# EAGLE design GW-RFM-V40-Mini011 (EAGLE 9.1.0)
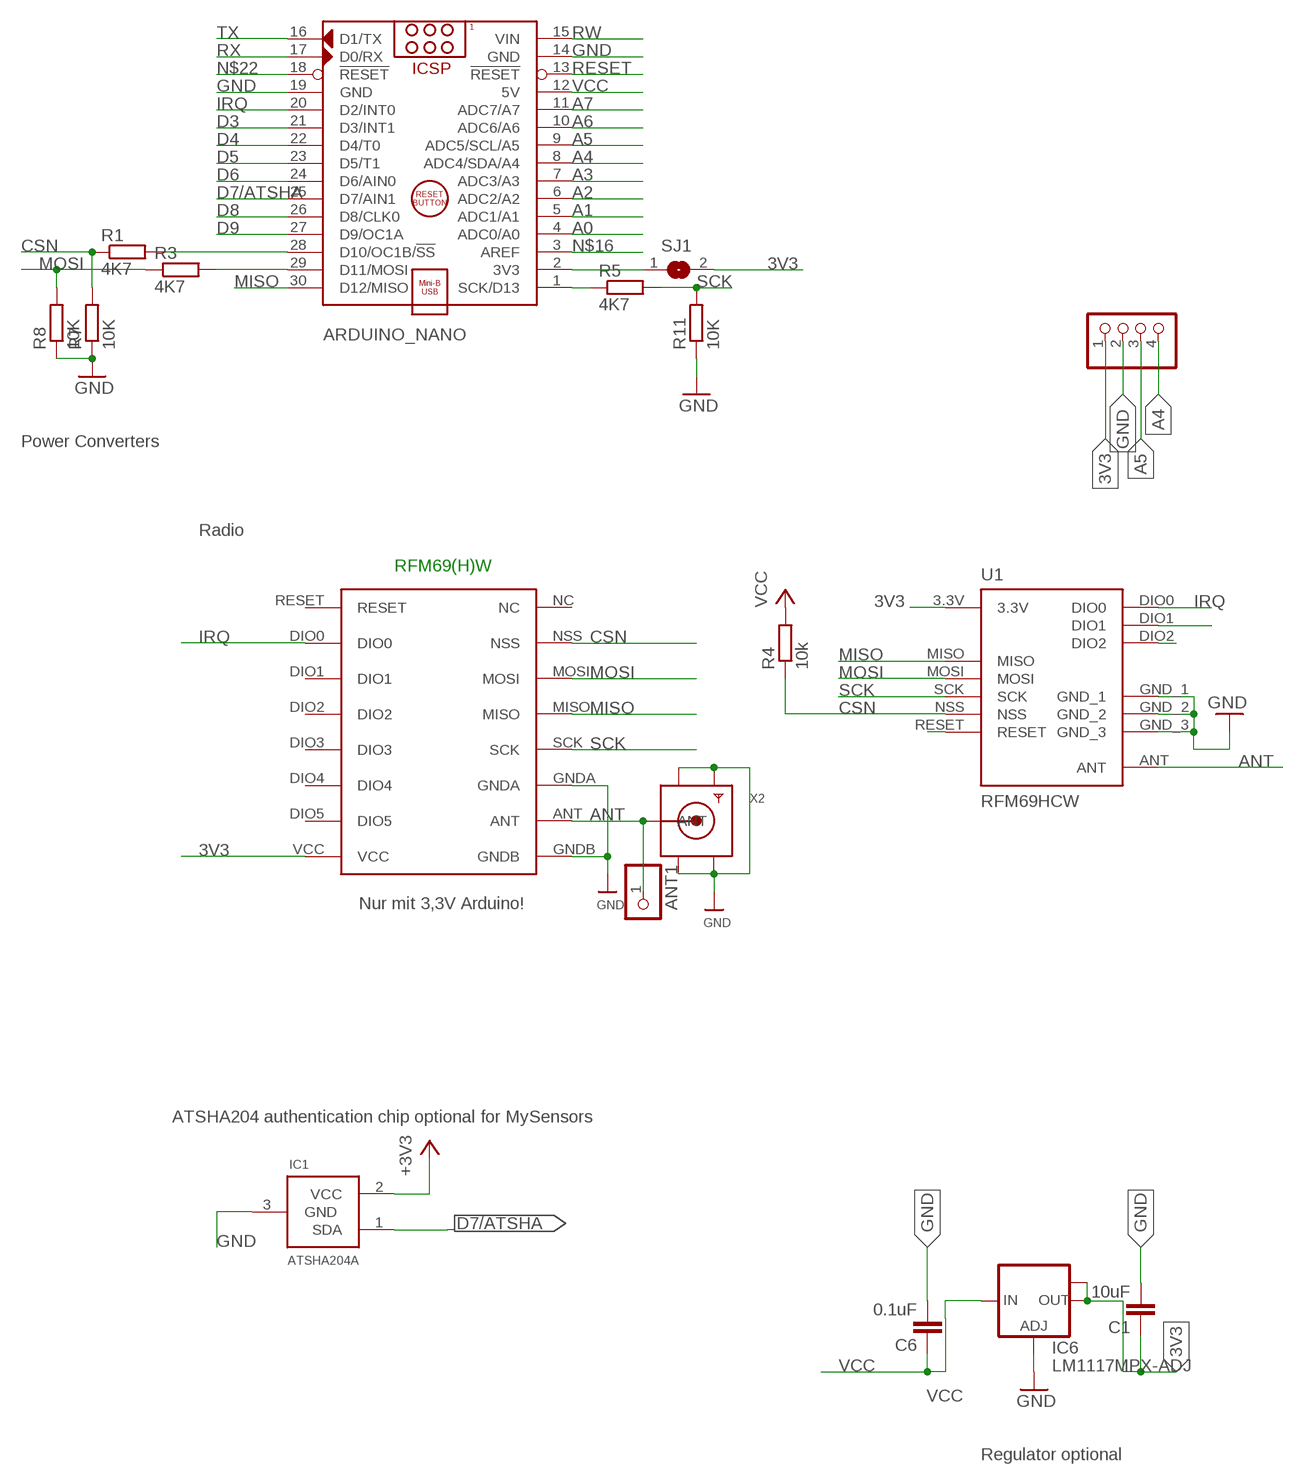
[diagram p0: schematic, sheet 1]

## Parts
ANT1  PINHD-1X1  [1X01]
ARDUINO_NANO  ARDUINO_NANO_OHNE-BOHR  [ARDUINO_NANO]
C1  10uF  C-EUC1210  [C1210]
C6  0.1uF  C-EUC1206  [C1206]
IC1  ATSHA204A  [SOT23]
IC6  LM1117MPX-ADJ  [SOT223]
JP17  PINHD-1X04_2.54-S  [1X04-S]
R1  4K7  R-EU_M0805  [M0805]
R3  4K7  R-EU_M0805  [M0805]
R4  10k  R-EU_M0805  [M0805]
R5  4K7  R-EU_M0805  [M0805]
R7  10K  R-EU_M0805  [M0805]
R8  10K  R-EU_M0805  [M0805]
R11  10K  R-EU_M0805  [M0805]
RFM69W  RFM69HW  [RFM]
SJ1  SJ  [SJ]
U1  RFM69HCW  [RFM69HCW-XXXS2]
X2  SMACONNECTOR_EDGE  [SMA_EDGELAUNCH]

## Nets
3V3: C1.1 IC1.2(VCC) IC6.2(OUT) IC6.TAB(OUT1) JP17.1 RFM69W.VCC SJ1.2 U1.3.3V ; supply symbol labelled +3V3
A0: ARDUINO_NANO.4(ADC0/A0)
A1: ARDUINO_NANO.5(ADC1/A1)
A2: ARDUINO_NANO.6(ADC2/A2)
A3: ARDUINO_NANO.7(ADC3/A3)
A4: ARDUINO_NANO.8(ADC4/SDA/A4) JP17.4
A5: ARDUINO_NANO.9(ADC5/SCL/A5) JP17.3
A6: ARDUINO_NANO.10(ADC6/A6)
A7: ARDUINO_NANO.11(ADC7/A7)
ANT: ANT1.1 RFM69W.ANT U1.ANT X2.P(ANT)
CSN: R1.1 R4.1 R7.2 RFM69W.NSS U1.NSS
D3: ARDUINO_NANO.21(D3/INT1)
D4: ARDUINO_NANO.22(D4/T0)
D5: ARDUINO_NANO.23(D5/T1)
D6: ARDUINO_NANO.24(D6/AIN0)
D7/ATSHA: ARDUINO_NANO.25(D7/AIN1) IC1.1(SDA)
D8: ARDUINO_NANO.26(D8/CLK0)
D9: ARDUINO_NANO.27(D9/OC1A)
GND [Power]: ARDUINO_NANO.14(GND) ARDUINO_NANO.19(GND) C1.2 C6.2 IC1.3(GND) IC6.1(ADJ) JP17.2 R7.1 R8.1 R11.1 RFM69W.GNDA RFM69W.GNDB U1.GND_1 U1.GND_2 U1.GND_3 X2.GND@1(GND4) X2.GND@2(GND3) X2.GND@3(GND2) X2.GND@4(GND1)
IRQ: ARDUINO_NANO.20(D2/INT0) RFM69W.DIO0 U1.DIO0
MISO: ARDUINO_NANO.30(D12/MISO) RFM69W.MISO U1.MISO
MOSI: R3.1 R8.2 RFM69W.MOSI U1.MOSI
N$3: ARDUINO_NANO.2(3V3) SJ1.1
N$5: ARDUINO_NANO.1(SCK/D13) R5.1
N$8: ARDUINO_NANO.28(D10/OC1B/!SS) R1.2
N$9: ARDUINO_NANO.29(D11/MOSI) R3.2
N$12: U1.DIO2
N$13: U1.RESET
N$15: U1.DIO1
N$16: ARDUINO_NANO.3(AREF)
N$22: ARDUINO_NANO.18(!RESET)
RESET: ARDUINO_NANO.13(!RESET)
RW: ARDUINO_NANO.15(VIN)
RX: ARDUINO_NANO.17(D0/RX)
SCK: R5.2 R11.2 RFM69W.SCK U1.SCK
TX: ARDUINO_NANO.16(D1/TX)
VCC [Power]: ARDUINO_NANO.12(5V) C6.1 IC6.3(IN) R4.2
Unconnected: RFM69W.DIO1 RFM69W.DIO2 RFM69W.DIO3 RFM69W.DIO4 RFM69W.DIO5 RFM69W.NC RFM69W.RESET

## Notes on the sheet
- Power Converters
- Radio
- RFM69(H)W
- Nur mit 3,3V Arduino!
- ATSHA204 authentication chip optional for MySensors
- Regulator optional

## Library data of the parts
ANT1 = pinhead:PINHD-1X1: PIN HEADER
ARDUINO_NANO = ArduinoNanoV30:ARDUINO_NANO_OHNE-BOHR: Arduino Nano V3.0 Module Overview: The Arduino Nano is a small, complete, and breadboard-friendly board based on the ATmega328 (Arduino Nano 3.x) or ATmega168 (Arduino Nano 2.x). It has more or less the same functionality of the Arduino Duemilanove, but in a different package. It lacks only a DC power jack, and works with a Mini-B USB cable instead of a standard one. The Nano was designed and is being produced by Gravitech <http://www.gravitech.us/arna30wiatp.html>. General specifications: Item Value Microcontroller Atmel ATmega168 or ATmega328 Operating Voltage (logic level) 5 V Input Voltage (recommended) 7-12 V Input Voltage (limits) 6-20 V Digital I/O Pins 14 (of which 6 provide PWM output) Analog Input Pins 8 DC Current per I/O Pin 40 mA Flash Memory 16 KB (ATmega168) or 32 KB (ATmega328) of which 2 KB used by bootloader SRAM 1 KB (ATmega168) or 2 KB (ATmega328) EEPROM 512 bytes (ATmega168) or 1 KB (ATmega328) Clock Speed 16 MHz Dimensions (Inches) 0.73" x 1.70" Dimensions (mm) 18mm x 45mm Overall height About 9 mm (not including pins) Weigth 5 g Power: The Arduino Nano can be powered via the Mini-B USB connection, 6-20V unregulated external power supply (pin 30), or 5V regulated external power supply (pin 27). The power source is automatically selected to the highest voltage source. Memory: The ATmega168 has 16 KB of flash memory for storing code (of which 2 KB is used for the bootloader); the ATmega328 has 32 KB, (also with 2 KB used for the bootloader). The ATmega168 has 1 KB of SRAM and 512 bytes of EEPROM (which can be read and written with the EEPROM library); the ATmega328 has 2 KB of SRAM and 1 KB of EEPROM. Input and Output: Each of the 14 digital pins on the Nano can be used as an input or output, using pinMode(), digitalWrite(), and digitalRead() functions. They operate at 5 volts. Each pin can provide or receive a maximum of 40 mA and has an internal pull-up resistor (disconnected by default) of 20-50 kOhms. In addition, some pins have specialized functions. Visit Arduino - ArduinoBoardNano <https://www.arduino.cc/en/Main/ArduinoBoardNano>
C1 C6 = rcl:C-EU: CAPACITOR, European symbol
IC1 = Sensor:ATSHA204A
IC6 = lm1117:LM1117MPX-ADJ
JP17 = pinhead-2:PINHD-1X04: PIN HEADER
R1 R3-R5 R7 R8 R11 = rcl:R-EU_: RESISTOR, European symbol
RFM69W = hoperf:RFM69HW
SJ1 = jumper:SJ: SMD solder JUMPER
U1 = doug:RFM69H
X2 = adafruit:SMACONNECTOR: SMA Connector 90° DIP SMA Connector, 50 Ohm (4UConnector: 07259)

## Net classes
0 default: width 0.254 mm
1 Power: width 0.406 mm

## Board
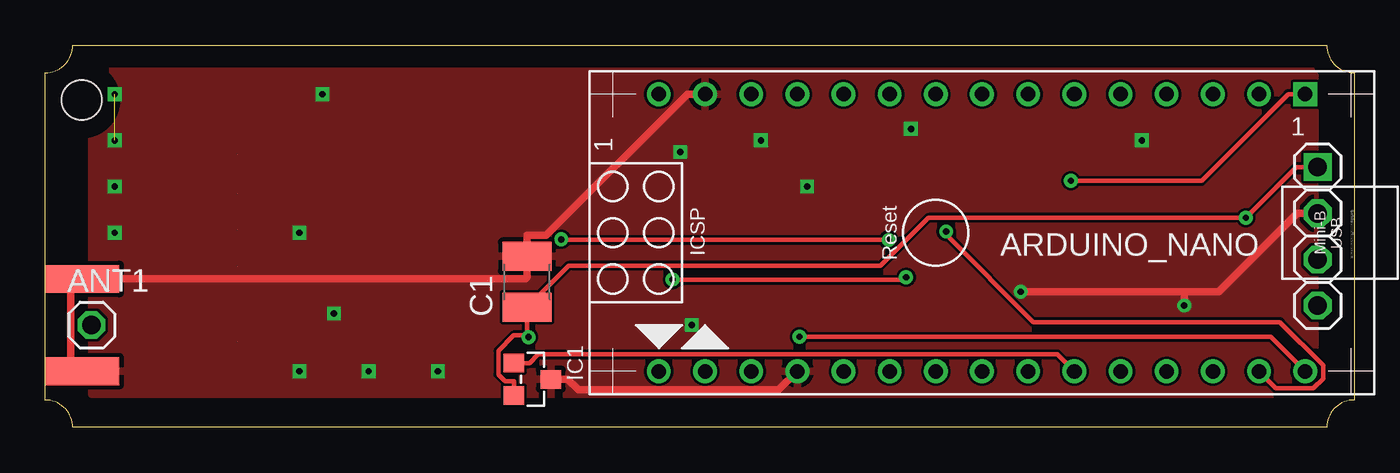
[diagram p1: board, top side]
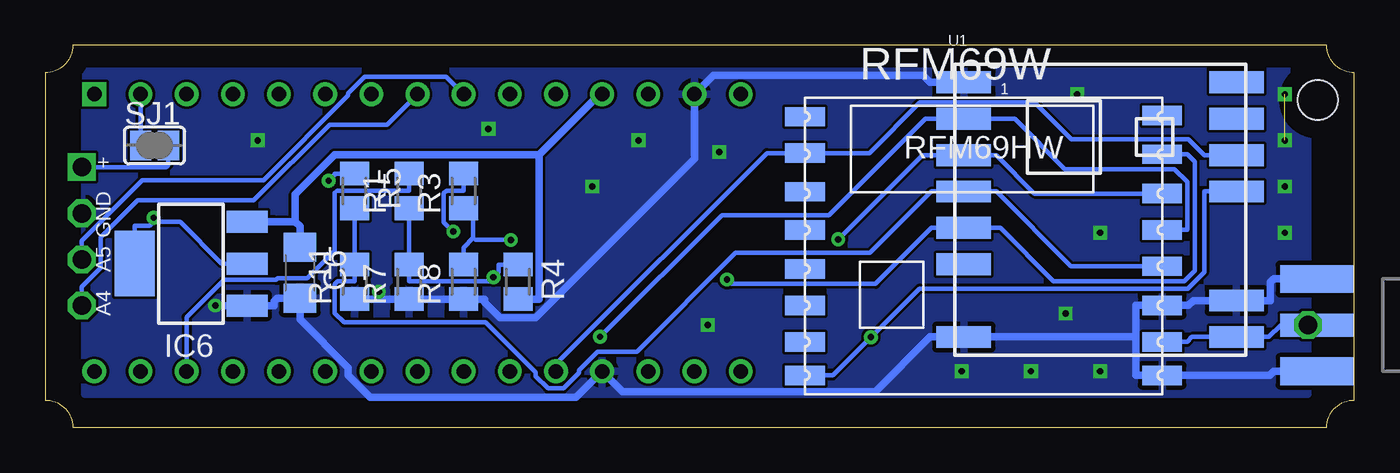
[diagram p2: board, bottom side, seen from below]

Size 72 x 21 mm. Coordinates in mm from the lower left corner, seen from the top.
Outline: 0,1.5 0,19.5 arc90 1.5,21 70.5,21 arc90 72,19.5 72,1.5 arc90 70.5,0 1.5,0 arc90 0,1.5
Copper layers (1*16): Top 0.035mm / dielectric 1.5mm / Bottom 0.035mm
Design rules "default": minimum track width 6mil, minimum drill 0.35mm, track to track 6mil, track to pad 6mil, pad to pad 6mil, via to via 6mil, smd to smd 6mil, copper to edge 40mil, drill to drill 6mil, minimum pad ring 10mil, minimum via ring 8mil, stop-mask expansion 4mil, vias tented up to drill 0mil, thermal gap 10mil
Holes 2.2 mm at 2,18

### Footprints (pad centres in the part's own frame; a part is rotated, then mirrored left to right if it is on the bottom)
1X01 = drill 1.016 octagon: 1 0,0
ARDUINO_NANO = drill 0.8 square: 1 -20.32,-7.62 | drill 0.8: 2 -17.78,-7.62; 3 -15.24,-7.62; 4 -12.7,-7.62; 5 -10.16,-7.62; 6 -7.62,-7.62; 7 -5.08,-7.62; 8 -2.54,-7.62; 9 0,-7.62; 10 2.54,-7.62; 11 5.08,-7.62; 12 7.62,-7.62; 13 10.16,-7.62; 14 12.7,-7.62; 15 15.24,-7.62; 16 15.24,7.62; 17 12.7,7.62; 18 10.16,7.62; 19 7.62,7.62; 20 5.08,7.62; 21 2.54,7.62; 22 0,7.62; 23 -2.54,7.62; 24 -5.08,7.62; 25 -7.62,7.62; 26 -10.16,7.62; 27 -12.7,7.62; 28 -15.24,7.62; 29 -17.78,7.62; 30 -20.32,7.62
C1210 = smd 1.6 x 2.7: 1 -1.4,0; 2 1.4,0
C1206 = smd 1.6 x 1.8: 1 -1.4,0; 2 1.4,0
SOT23 = smd 1.016 x 1.143: 1 -0.889,-1.016; 2 0.889,-1.016; 3 0,1.016
SOT223 = smd 1.219 x 2.235: 1 -2.311,-3.099; 2 0,-3.099; 3 2.311,-3.099 | smd 3.6 x 2.2: TAB 0,3.099
1X04-S = drill 1.016 square: 1 -3.81,0 | drill 1.016 octagon: 2 -1.27,0; 3 1.27,0; 4 3.81,0
M0805 = smd 1.3 x 1.6: 1 -0.95,0; 2 0.95,0
RFM = smd 2.184 x 1.067: ANT 19.651,2.889; DIO0 0,13.27; DIO1 0,11.143; DIO2 0,9.047; DIO3 0,6.889; DIO4 0,4.889; DIO5 0,2.889; GNDA 19.651,4.889; GNDB 19.651,1.048; MISO 19.651,9.047; MOSI 19.651,11.047; NC 19.651,15.334; NSS 19.651,13.206; RESET 0,15.27; SCK 19.651,7.048; VCC 0,1.048
SJ = smd 1.168 x 1.6: 1 -0.762,0; 2 0.762,0
RFM69HCW-XXXS2 = smd 3 x 1.2: 3.3V 7.5,1; ANT 7.5,-7; DIO0 7.5,3; DIO1 7.5,5; DIO2 7.5,7; GND_1 7.5,-5; GND_2 -7.5,-7; GND_3 -7.5,7; MISO -7.5,5; MOSI -7.5,3; NSS -7.5,-1; RESET -7.5,-3; SCK -7.5,1
SMA_EDGELAUNCH = smd 4.064 x 1.524: GND@1 2.032,-2.54; GND@2 2.032,2.54 | smd 4.064 x 1.524 bottom: GND@3 2.032,2.54; GND@4 2.032,-2.54 | smd 4.064 x 1.27: P 2.032,0

### Placement (x,y rotation side)
ANT1  2.54,5.62 0 top
ARDUINO_NANO  48.99,10.7 180 top
C1  26.5,8 90 top
C6  58,8.5 270 bottom
IC1  26.79,2.64 270 top
IC6  64,9 90 bottom
JP17  70,10.5 270 top
R1  52,13 90 bottom
R3  49,13 90 bottom
R4  46,8 270 bottom
R5  55,13 270 bottom
R7  52,8 90 bottom
R8  49,8 90 bottom
R11  55,8 90 bottom
RFM69W  30.21,1.81 0 bottom
SJ1  66,15.5 0 bottom
U1  13.97,11.97 0 bottom
X2  0,5.62 180 bottom

### Tracks (layer width: path | path; a pad name or v marks a point on that pad's centre or on a via)
3V3  (via drill 0.35 pad 0.76)
  Top 0.254: 26.49,5.05 25.77,5.05 24.92,4.21 24.92,2.9 25.28,2.54 25.77,2.54 IC1.2 | v26.58,4.96 26.49,5.05 | 26.49,5.05 26.49,5.51 26.5,5.52 C1.1 28.77,8.87 45.93,8.87 48.58,11.52 v66.05,11.52 68.83,14.31 68.96,14.31 JP17.1
  Bottom 0.254: U1.3.3V 8.25,12.97 8.25,8.52 9.14,7.63 23.91,7.63 v26.58,4.96 28.68,2.86 28.84,2.86 RFM69W.VCC | 66.05,11.3 64.6,11.3 62.3,9 IC6.2 | 66.05,11.3 66.27,11.08 67.1,11.08 IC6.TAB | v66.05,11.52 66.05,11.3 | JP17.1 65.35,14.31 65.24,14.42 SJ1.2
A4
  Bottom 0.254: JP17.4 70,7.73 68.96,8.77 68.96,10.46 66.93,12.48 60.53,12.48 56.37,16.65 53.2,16.65 ARDUINO_NANO.8
A5
  Bottom 0.254: JP17.3 70,10.27 66.69,13.58 60.01,13.58 55.34,18.25 55.34,18.38 54.43,19.28 49.95,19.28 ARDUINO_NANO.9
ANT  (1 unrouted)
  Bottom 0.254: RFM69W.ANT 9.19,4.7 8.92,4.97 U1.ANT 4.69,4.97 4.04,5.62 ANT1.1 X2.P
CSN  (via drill 0.35 pad 0.76)  (1 unrouted)
  Top 0.254: v34.5,8.13 47.23,8.13 v47.35,8.25
  Bottom 0.254: RFM69W.NSS 9.19,15.02 8.77,14.6 8.77,8.62 9.35,8.04 16.53,8.04 19.46,10.97 U1.NSS 22.36,10.97 23.25,10.97 26.33,7.89 34.26,7.89 v34.5,8.13 | R1.1 52,11.12 52,9.88 R7.2 52,8.02 47.58,8.02 v47.35,8.25 47.08,8.52 47.08,8.95 R4.1
D7/ATSHA
  Top 0.254: IC1.1 26.62,3.53 27.11,4.01 55.68,4.01 ARDUINO_NANO.25
GND  (via drill 0.35 pad 0.76)  (1 unrouted)
  Top 0.406: 62.66,7.45 64.56,7.45 | 64.56,7.45 | 64.56,7.45 68.88,11.77 JP17.2 | v53.65,7.45 62.66,7.45 | 62.66,7.45 v62.66,6.7 | X2.GND@2 1.38,3.73 1.38,7.51 X2.GND@1 26.42,8.16 26.5,8.24 C1.2 26.5,10.56 27.55,10.56 35.32,18.32 ARDUINO_NANO.14 | IC1.3 28.73,2.64 29.32,2.05 40.34,2.05 ARDUINO_NANO.19
  Bottom 0.406: v62.66,6.7 v62.65,6.69 62.37,6.69 IC6.1 59.43,6.69 59.43,6.93 59.26,7.1 C6.2 58,5.94 55.34,3.28 55.34,2.86 54.13,1.65 42.8,1.65 ARDUINO_NANO.19 40.26,1.97 26.33,1.97 23.33,4.97 U1.GND_2 19.61,4.97 12.01,4.97 | U1.GND_3 23.33,18.97 23.71,19.36 35.25,19.36 ARDUINO_NANO.14 36.29,14.76 45.03,6.02 46.98,6.02 47.84,6.88 47.84,7.05 R8.1 R7.1 53.65,7.05 | 12.01,4.97 12.01,6.7 RFM69W.GNDA 9.11,6.7 8.84,6.97 U1.GND_1 4.61,6.97 4.61,7.96 4.42,8.16 X2.GND@1 | 12.01,4.97 12.01,2.86 RFM69W.GNDB 4.64,2.86 4.42,3.08 X2.GND@2 | 53.65,7.05 R11.1 | v53.65,7.45 53.65,7.05
  other vias: 3.81,10.7 3.81,13.24 3.81,15.78 3.81,18.32 15.24,18.32 13.97,10.7 13.97,3.08 17.78,3.08 21.59,3.08 39.37,15.78 41.91,13.24 15.88,6.26 34.92,15.14 47.62,16.41 60.33,15.78 35.56,5.62
  pour Bottom: 2.54,19.59 2.54,1.81 69.85,1.81 69.85,19.59
  pour Top: 2.54,1.81 2.54,19.59 69.85,19.59 69.85,1.81
IRQ
  Bottom 0.254: ARDUINO_NANO.20 43.91,3.48 32.31,15.08 RFM69W.DIO0 26.67,15.08 23.88,17.87 17.59,17.87 15.54,15.83 9.11,15.83 8.25,14.97 U1.DIO0
MISO  (via drill 0.35 pad 0.76)  (1 unrouted)
  Top 0.254: v41.49,4.97 67.42,4.97 ARDUINO_NANO.30
  Bottom 0.254: RFM69W.MISO 9.19,10.86 9.19,13.51 9.88,14.2 15.9,14.2 18.66,16.97 U1.MISO 23.59,16.97 28.88,11.68 34.79,11.68 v41.49,4.97
MOSI  (via drill 0.35 pad 0.76)  (1 unrouted)
  Top 0.254: v28.38,10.34 28.41,10.3 v46.4,10.3
  Bottom 0.254: v46.4,10.3 48.34,10.3 48.46,10.42 | RFM69W.MOSI 17.58,12.86 19.69,14.97 U1.MOSI 23.75,14.97 v28.38,10.34 | 48.46,10.42 49,9.88 R8.2 | 48.46,10.42 48.46,12.05 R3.1
N$3
  Bottom 0.254: SJ1.1 ARDUINO_NANO.2
N$5  (via drill 0.35 pad 0.76)
  Top 0.254: ARDUINO_NANO.1 68.38,18.32 63.61,13.56 v56.42,13.56
  Bottom 0.254: R5.1 56.08,13.95 56.08,13.9 v56.42,13.56
N$8
  Bottom 0.254: R1.2 52,13.02 55.96,13.02 56.08,12.9 56.08,9.71 57.6,8.19 59.22,8.19 59.3,8.11 62.18,8.11 64.23,6.06 ARDUINO_NANO.28
N$9  (via drill 0.35 pad 0.76)
  Top 0.254: ARDUINO_NANO.29 67.71,2.14 69.77,2.14 70.29,2.67 70.29,3.42 67.92,5.79 54.35,5.79 49.56,10.58 v49.56,10.76
  Bottom 0.254: v49.56,10.76 50.08,11.29 50.08,12.87 49.93,13.02 49,13.02 R3.2
SCK  (1 unrouted)
  Bottom 0.254: RFM69W.SCK 15.58,8.86 19.69,12.97 U1.SCK 23.25,12.97 26.63,9.59 34.02,9.59 39.45,4.16 41.62,4.16 42.64,3.14 42.64,3 43.51,2.13 44.35,2.13 45.04,2.82 45.04,3.03 47.77,5.77 55.57,5.77 56.08,6.28 56.08,7.87 55.93,8.02 55,8.02 R11.2 R5.2
VCC
  Bottom 0.406: 58.26,11.31 58,11.06 C6.1 | 58.26,11.31 59.43,11.31 IC6.3 | 58.26,11.31 58.26,12.81 56.09,14.98 44.84,14.98 | 44.84,14.98 41.5,18.32 ARDUINO_NANO.12 | 44.84,14.98 44.84,7.05 R4.2

### Text on the board
bNames: + | GND | A5 | A4